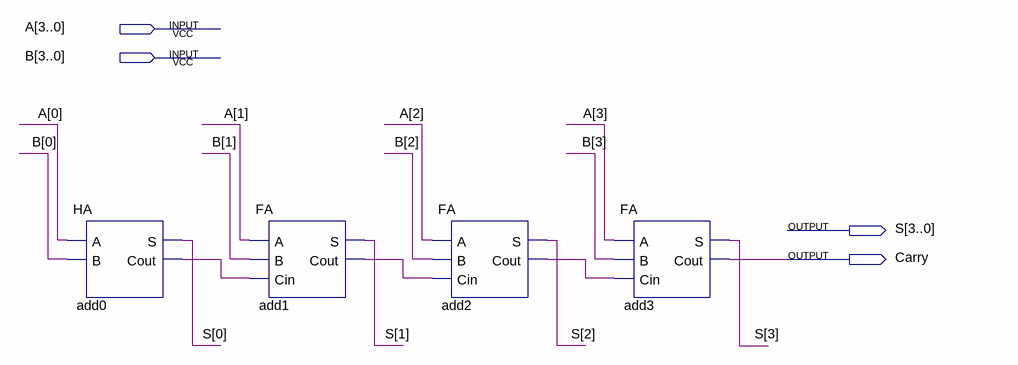
[diagram p0: schematic sheet]
// Quartus schematic RCA.bdf as structural Verilog: 4 symbols, 4 pins
module RCA (
  input  [3:0] A,
  input  [3:0] B,
  output [3:0] S,
  output Carry
);

  wire add0_cout, add1_cout, add2_cout;

  HA add0 (.A(A[0]), .B(B[0]), .S(S[0]), .Cout(add0_cout));
  FA add1 (.A(A[1]), .B(B[1]), .Cin(add0_cout), .S(S[1]), .Cout(add1_cout));
  FA add2 (.A(A[2]), .B(B[2]), .Cin(add1_cout), .S(S[2]), .Cout(add2_cout));
  FA add3 (.A(A[3]), .B(B[3]), .Cin(add2_cout), .S(S[3]), .Cout(Carry));
endmodule
